# Altium schematic sheet PROGRAM COUNTER.SchDoc
size A4
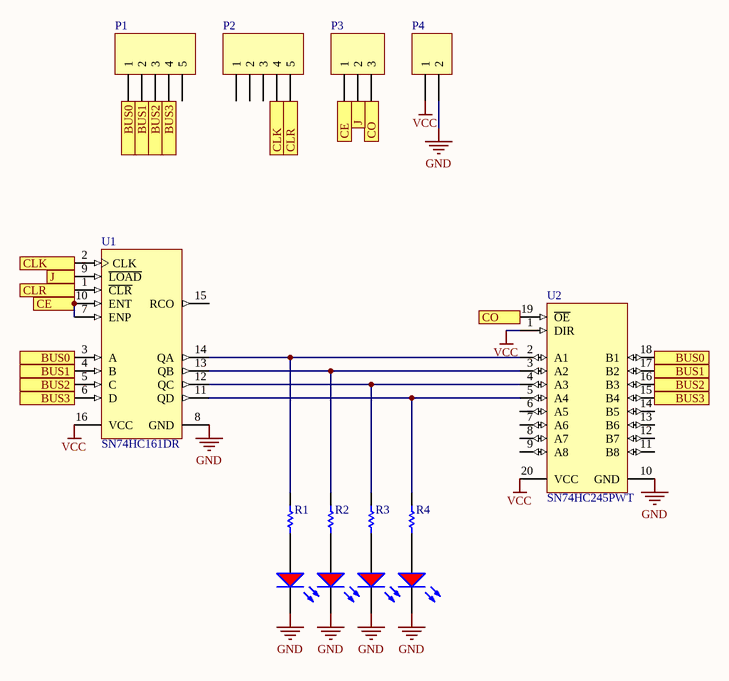
[diagram p0: PROGRAM COUNTER.SchDoc]

## Parts
LED1  LTST-C170CKT  [LTST-C170CKT_V]  (value not drawn)
LED2  LTST-C170CKT  [LTST-C170CKT_V]  (value not drawn)
LED3  LTST-C170CKT  [LTST-C170CKT_V]  (value not drawn)
LED4  LTST-C170CKT  [LTST-C170CKT_V]  (value not drawn)
P1  Header 5  [HDR1X5]  (value not drawn)
P2  Header 5  [HDR1X5]  (value not drawn)
P3  Header 3  [HDR1X3]  (value not drawn)
P4  Header 2  [HDR1X2]  (value not drawn)
R1  220R 1% 0603(1608)  [RESC0603(1608)_N]  (value not drawn)
R2  220R 1% 0603(1608)  [RESC0603(1608)_N]  (value not drawn)
R3  220R 1% 0603(1608)  [RESC0603(1608)_N]  (value not drawn)
R4  220R 1% 0603(1608)  [RESC0603(1608)_N]  (value not drawn)
U1  SN74HC161DR  [D0016A_M]
U2  SN74HC245PWT  [PW0020A_M]

## Ports
BUS0, BUS1, BUS2, BUS3, CE, CLK, CLR, CO, J

## Nets
GND: LED1.2(K) LED2.2(K) LED3.2(K) LED4.2(K) P4.2 U1.8(GND) U2.10(GND)
VCC: P4.1 U1.16(VCC) U2.1(DIR) U2.20(VCC)
BUS0: P1.1 U1.3(A) U2.18(B1) ; port BUS0
BUS1: P1.2 U1.4(B) U2.17(B2) ; port BUS1
BUS2: P1.3 U1.5(C) U2.16(B3) ; port BUS2
BUS3: P1.4 U1.6(D) U2.15(B4) ; port BUS3
CE: P3.1 U1.7(ENP) U1.10(ENT) ; port CE
CLK: P2.4 U1.2(CLK) ; port CLK
CLR: P2.5 U1.1(~{CLR}) ; port CLR
CO: P3.3 U2.19(~{OE}) ; port CO
J: P3.2 U1.9(~{LOAD}) ; port J
NetLED1_1: LED1.1(A) R1.1
NetLED2_1: LED2.1(A) R2.1
NetLED3_1: LED3.1(A) R3.1
NetLED4_1: LED4.1(A) R4.1
NetR1_2: R1.2 U1.14(QA) U2.2(A1)
NetR2_2: R2.2 U1.13(QB) U2.3(A2)
NetR3_2: R3.2 U1.12(QC) U2.4(A3)
NetR4_2: R4.2 U1.11(QD) U2.5(A4)

Not connected (* = marked no-connect by the designer): P1 5; P2 1 2 3; U1 15(RCO); U2 6(A5) 7(A6) 8(A7) 9(A8) 11(B8) 12(B7) 13(B6) 14(B5)

## Library data of the parts
LED1-LED4 = CMP-1674-00001-5: LED Uni-Color Red, 100 mW, 200 mA, -55 to 85 degC, 2-Pin SMD, RoHS, Tape and Reel; Manufacturer: Lite-On; ComponentLink1Description: Manufacturer URL; PackageReference: C170CKT; Package Quantity: 3000; Packaging: Tape and Reel; Pins: 2; ComponentLink2URL: http://media.digikey.com/pdf/Data%20Sheets/Lite-On%20PDFs/LTST-C170CKT.pdf; Max Operating Temperature: 85 degC; Min Operating Temperature: -55 degC; ComponentLink1URL: http://www.us.liteon.com/; Mounting Technology: Surface Mount; Mount: Surface Mount; Length: 2 mm; ComponentLink2Description: Datasheet; DatasheetVersion: 03/2003; Height: 1.1 mm; PackageDescription: 2-Pin Surface Mount Device, Body 2 x 1.25 mm; RoHSCompliant: true; Colour: Red
P1 P2 = Header 5: Header, 5-Pin; LatestRevisionDate: 17-Jul-2002; LatestRevisionNote: Re-released for DXP Platform.; Publisher: Altium Limited
P3 = Header 3: Header, 3-Pin; LatestRevisionDate: 17-Jul-2002; LatestRevisionNote: Re-released for DXP Platform.; Publisher: Altium Limited
P4 = Header 2: Header, 2-Pin; LatestRevisionDate: 17-Jul-2002; LatestRevisionNote: Re-released for DXP Platform.; Publisher: Altium Limited
R1-R4 = CMP-1012-00433-1: 220R 0.1W 1% 0603 (1608 Metric)  SMD; Value: 220.00 Ohm; Case-EIA: 0603; Case-Metric: 1608; Technology: SMT; Tolerance: 1 %; Power: 0.1 W
U1 = CMP-1623-00181-2: 4-Bit Synchronous Binary Counters, D0016A, LARGE T&R; Manufacturer: Texas Instruments; Rating: Catalog; Bits(#): 4; VCC(Min)(V): 2; Inputs: 1; Voltage(Nom)(V): 3.3,5; F @ Nom Voltage(Max)(Mhz): 28; Technology Family: HC; Output Drive (IOL/IOH)(Max)(mA): 5.2/-5.2; VCC(Max)(V): 6; ICC @ Nom Voltage(Max)(mA): 0.08; Output Type: CMOS; Schmitt Trigger: No; tpd @ Nom Voltage(Max)(ns): 46; Input Type: LVTTL/CMOS; Type: Binary; DatasheetVersion: SCLS297D; Code_JEDEC: MS-012 variation AC; Function: Counter; Generic Part Number: SN74HC161; Operating Temperature Range(C): -40 to 85; PackageReference: D0016A
U2 = CMP-1620-00532-1: Octal Bus Transceivers With 3-State Outputs, PW0020A, SMALL T&R; Manufacturer: Texas Instruments; tpd @ Nom Voltage(Max)(ns): 22; Output Type: CMOS; Rating: Catalog; Bits(#): 8; Schmitt Trigger: No; Technology Family: HC; VCC(Max)(V): 6; ICC @ Nom Voltage(Max)(mA): 0.08; VCC(Min)(V): 2; F @ Nom Voltage(Max)(Mhz): 28; Output Drive (IOL/IOH)(Max)(mA): -6/6; ComponentLink3URL: http://www.ti.com/lit/ml/mpds362/mpds362.pdf; ComponentLink3Description: Package Specification; Generic Part Number: SN74HC245; ComponentLink2Description: Datasheet; DatasheetVersion: SCLS131D; PackageReference: PW0020A; ComponentLink1Description: Manufacturer URL; ComponentLink1URL: http://www.ti.com/; Operating Temperature Range(C): -40 to 85; ComponentLink2URL: http://www.ti.com/lit/ds/symlink/sn74hc245.pdf; PartNumber: SN74HC245PWT; Code_JEDEC: MO-153; Voltage(Nom)(V): 6; Input Type: CMOS